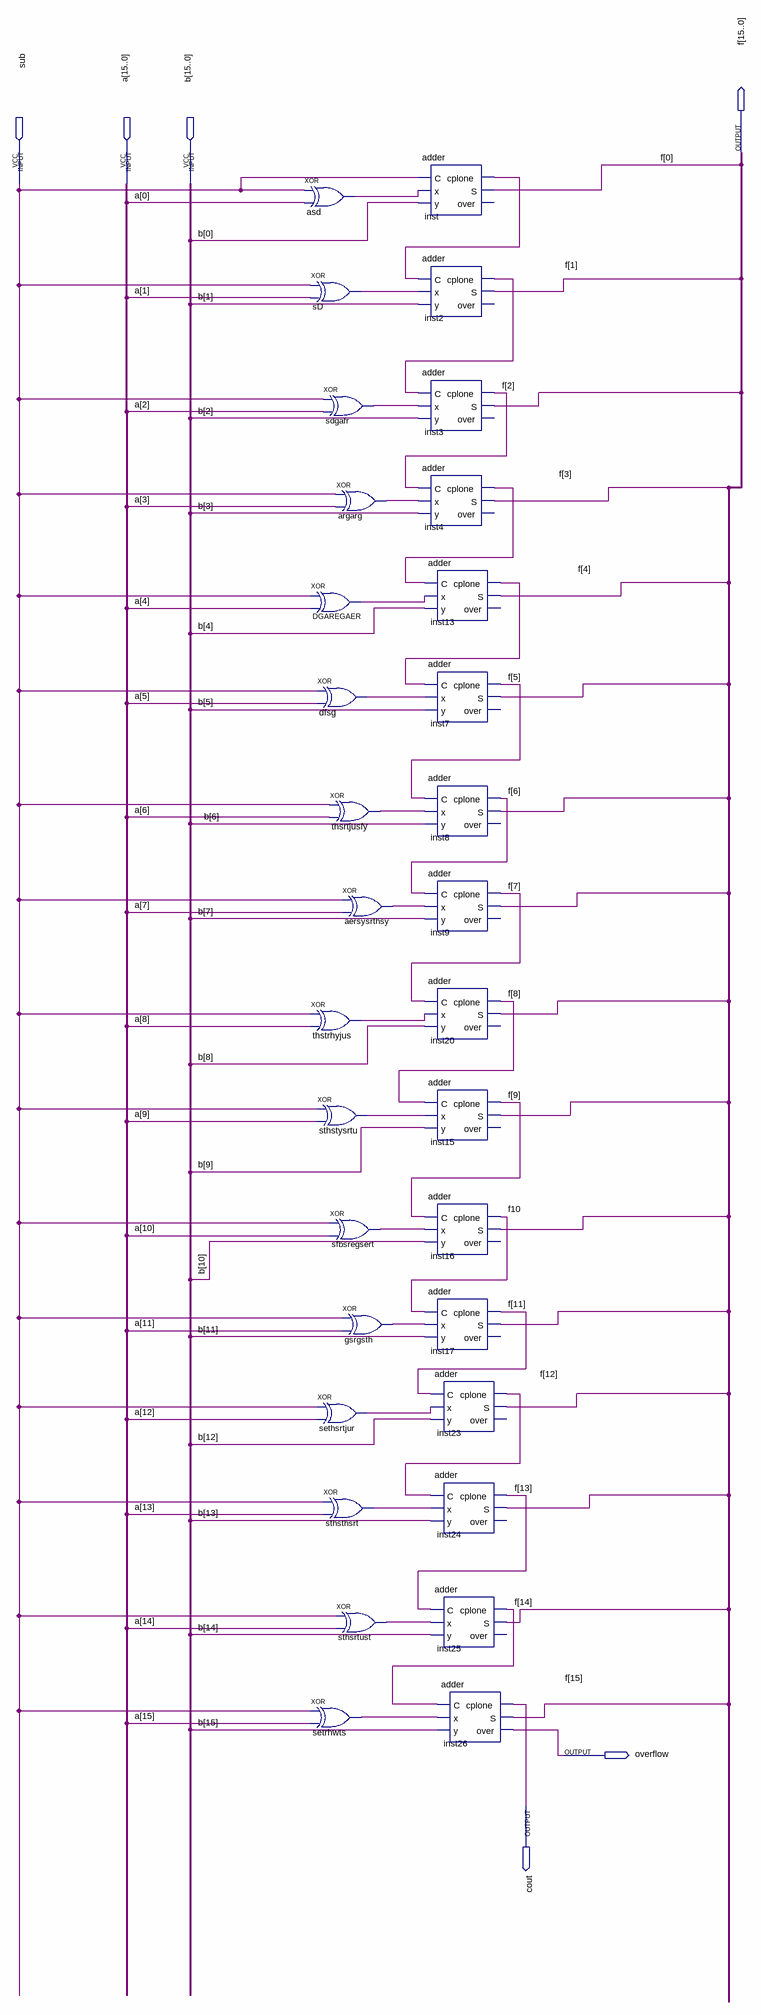
[diagram p0: schematic sheet]
// Quartus schematic adder16.bdf as structural Verilog: 32 symbols, 6 pins
module adder16 (
  input  sub,
  input  [15:0] a,
  input  [15:0] b,
  output [15:0] f,
  output overflow,
  output cout
);

  wire aersysrthsy_out, argarg_out, asd_out, dfsg_out, DGAREGAER_out, gsrgsth_out, inst2_cplone,
       inst3_cplone, inst4_cplone, inst7_cplone, inst8_cplone, inst9_cplone, inst13_cplone, inst15_cplone,
       inst16_cplone, inst17_cplone, inst20_cplone, inst23_cplone, inst24_cplone, inst25_cplone, inst_cplone,
       sD_out, sdgafr_out, sethsrtjur_out, setrhwts_out, sfbsregsert_out, sthsrtust_out, sthsthsrt_out,
       sthstysrtu_out, thsrtjusfy_out, thstrhyjus_out;

  xor asd (asd_out, sub, a[0]);
  xor sD (sD_out, sub, a[1]);
  xor sdgafr (sdgafr_out, sub, a[2]);
  xor argarg (argarg_out, sub, a[3]);
  xor DGAREGAER (DGAREGAER_out, sub, a[4]);
  xor dfsg (dfsg_out, sub, a[5]);
  xor thsrtjusfy (thsrtjusfy_out, sub, a[6]);
  xor aersysrthsy (aersysrthsy_out, sub, a[7]);
  xor thstrhyjus (thstrhyjus_out, sub, a[8]);
  xor sthstysrtu (sthstysrtu_out, sub, a[9]);
  xor sfbsregsert (sfbsregsert_out, sub, a[10]);
  xor gsrgsth (gsrgsth_out, sub, a[11]);
  xor sethsrtjur (sethsrtjur_out, sub, a[12]);
  xor sthsthsrt (sthsthsrt_out, sub, a[13]);
  xor sthsrtust (sthsrtust_out, sub, a[14]);
  xor setrhwts (setrhwts_out, sub, a[15]);
  adder inst (.C(sub), .x(asd_out), .y(b[0]), .cplone(inst_cplone), .S(f[0]));  // open: over
  adder inst2 (.C(inst_cplone), .x(sD_out), .y(b[1]), .cplone(inst2_cplone), .S(f[1]));  // open: over
  adder inst3 (.C(inst2_cplone), .x(sdgafr_out), .y(b[2]), .cplone(inst3_cplone), .S(f[2]));  // open: over
  adder inst4 (.C(inst3_cplone), .x(argarg_out), .y(b[3]), .cplone(inst4_cplone), .S(f[3]));  // open: over
  adder inst13 (.C(inst4_cplone), .x(DGAREGAER_out), .y(b[4]), .cplone(inst13_cplone), .S(f[4]));  // open: over
  adder inst7 (.C(inst13_cplone), .x(dfsg_out), .y(b[5]), .cplone(inst7_cplone), .S(f[5]));  // open: over
  adder inst8 (.C(inst7_cplone), .x(thsrtjusfy_out), .y(b[6]), .cplone(inst8_cplone), .S(f[6]));  // open: over
  adder inst9 (.C(inst8_cplone), .x(aersysrthsy_out), .y(b[7]), .cplone(inst9_cplone), .S(f[7]));  // open: over
  adder inst20 (.C(inst9_cplone), .x(thstrhyjus_out), .y(b[8]), .cplone(inst20_cplone), .S(f[8]));  // open: over
  adder inst15 (.C(inst20_cplone), .x(sthstysrtu_out), .y(b[9]), .cplone(inst15_cplone), .S(f[9]));  // open: over
  adder inst16 (.C(inst15_cplone), .x(sfbsregsert_out), .y(b[10]), .cplone(inst16_cplone), .S(f[10]));  // open: over
  adder inst17 (.C(inst16_cplone), .x(gsrgsth_out), .y(b[11]), .cplone(inst17_cplone), .S(f[11]));  // open: over
  adder inst23 (.C(inst17_cplone), .x(sethsrtjur_out), .y(b[12]), .cplone(inst23_cplone), .S(f[12]));  // open: over
  adder inst24 (.C(inst23_cplone), .x(sthsthsrt_out), .y(b[13]), .cplone(inst24_cplone), .S(f[13]));  // open: over
  adder inst25 (.C(inst24_cplone), .x(sthsrtust_out), .y(b[14]), .cplone(inst25_cplone), .S(f[14]));  // open: over
  adder inst26 (.C(inst25_cplone), .x(setrhwts_out), .y(b[15]), .cplone(cout), .S(f[15]), .over(overflow));
endmodule
